# EAGLE design Grove - GPS v1.1 (EAGLE 6.3)
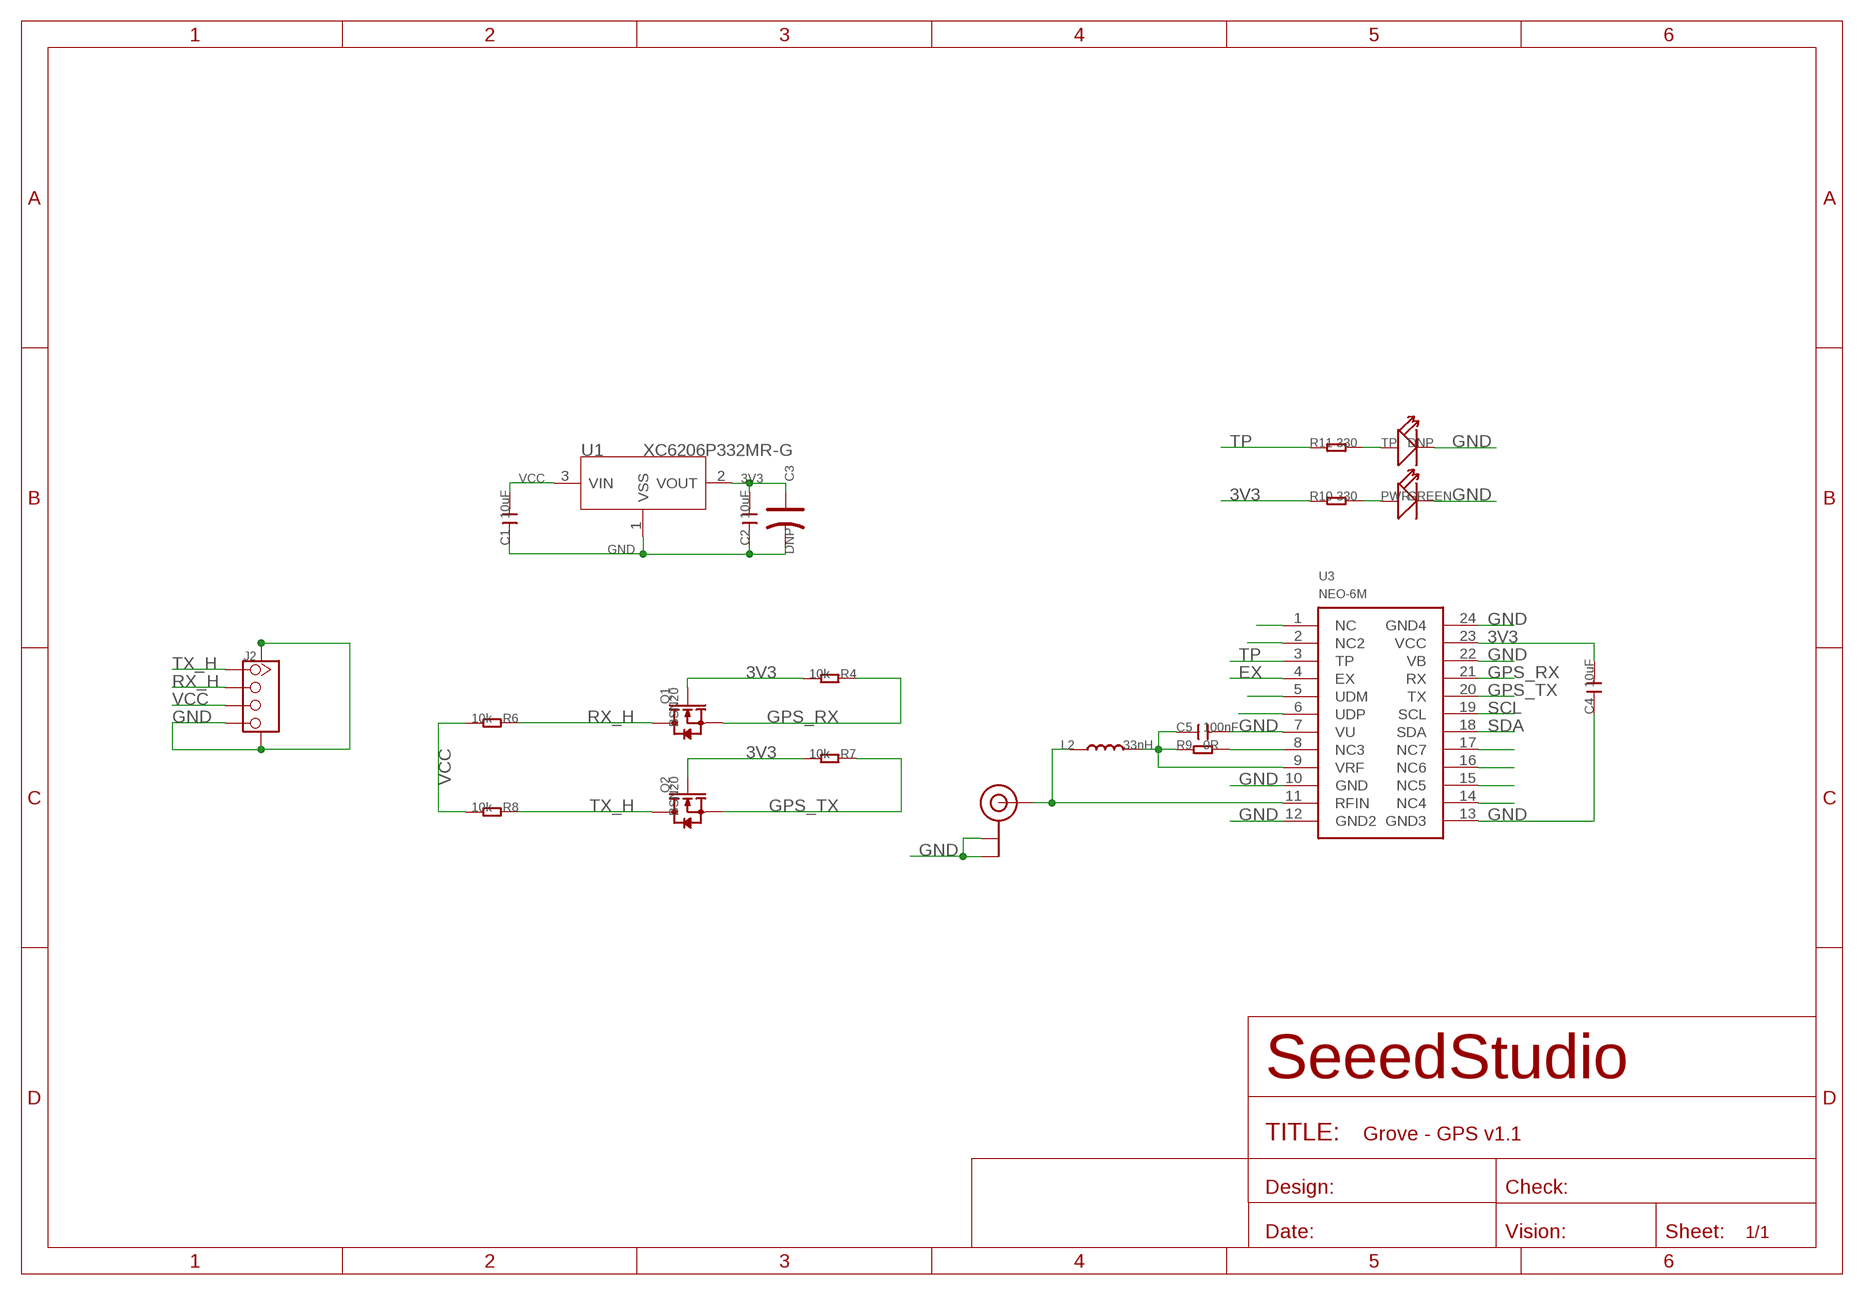
[diagram p0: schematic, sheet 1]

## Parts
C1  10uF  C-0805  [C0805]
C2  10uF  C-0805  [C0805]
C3  DNP  CAP-AVX-A  [AVX-A]
C4  10uF  C-0805  [C0805]
C5  100nF  C-0603  [C0603]
J2  TWIG-4P-2.0-SMD-FEMALE-REINFORCE'DD'  [4P-SMD-2.0]
L2  33nH  L'0603'  [L0603]
PWR  GREEN  LED'0603'  [LED-0603]
Q1  BSN20  MOSFET-N'SOT23'  [SOT23]
Q2  BSN20  MOSFET-N'SOT23'  [SOT23]
R4  10k  R-0603  [R0603]
R6  10k  R-0603  [R0603]
R7  10k  R-0603  [R0603]
R8  10k  R-0603  [R0603]
R9  0R  R-0603  [R0603]
R10  330  R-0603  [R0603]
R11  330  R-0603  [R0603]
TP  DNP  LED'0603'  [LED-0603]
U1  XC6206P332MR-G  XC6206MR  [SOT23]
U3  NEO-6M  [28P-1.1-16.0X12.2]
U4  U.FL  [U.FL]

## Nets
3V3: C2.2 C3.+ C4.2 Q1.1(G) Q2.1(G) R4.2 R7.2 R10.1 U1.2(VOUT) U3.23(VCC)
EX: U3.4(EX)
GND: C1.1 C2.1 C3.- C4.1 C5.2 J2.4 J2.SS1 J2.SS2 PWR.- TP.- U1.1(VSS) U3.7(VU) U3.10(GND) U3.12(GND2) U3.13(GND3) U3.22(VB) U3.24(GND4) U4.P$1(GND) U4.P$2(GND)
GPS_RX: Q1.2(S) R4.1 U3.21(RX)
GPS_TX: Q2.2(S) R7.1 U3.20(TX)
N$1: U3.1(NC)
N$2: L2.1 U3.11(RFIN) U4.P$3(SIGNAL)
N$3: C5.1 L2.2 R9.1 U3.9(VRF)
N$4: U3.2(NC2)
N$5: U3.14(NC4)
N$6: PWR.+ R10.2
N$7: R9.2 U3.8(NC3)
N$8: U3.15(NC5)
N$9: R11.2 TP.+
N$10: U3.16(NC6)
N$11: U3.17(NC7)
N$12: U3.5(UDM)
N$13: U3.6(UDP)
RX_H: J2.2 Q1.3(D) R6.1
SCL: U3.19(SCL)
SDA: U3.18(SDA)
TP: R11.1 U3.3(TP)
TX_H: J2.1 Q2.3(D) R8.1
VCC: C1.2 J2.3 R6.2 R8.2 U1.3(VIN)

## Library data of the parts
C1 C2 C4 C5 = Discrete:C*: Ceramic Capacitors
C3 = Discrete:CAP*: Electrolytic Capacitors,Tantalum Capacitors and Super Capacitors
J2 = Connector:TWIG-4P-2.0-SMD-FEMALE-REINFORCE
L2 = Discrete:L*
PWR TP = Discrete:LED*
Q1 Q2 = Discrete:MOSFET-N: IRLL014: http://www.vishay.com/docs/91319/sihll014.pdf
R4 R6-R11 = Discrete:R*
U1 = IC:XC6206: LOW ESR Cap.Compatible Positive Voltage Regulators
U3 = template:NEO-6M
U4 = SparkFun2:U.FL

## Net classes
0 default: width 0.003 mm, drill 0.254 mm, clearance 0.152 mm

## Board
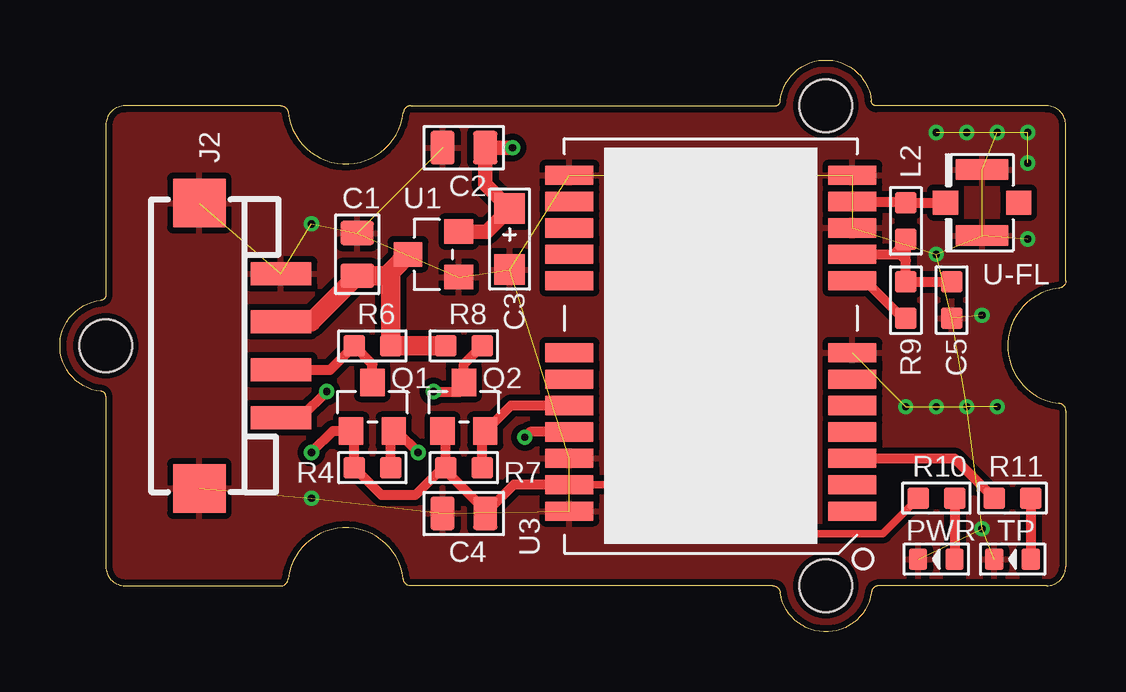
[diagram p1: board, top side]
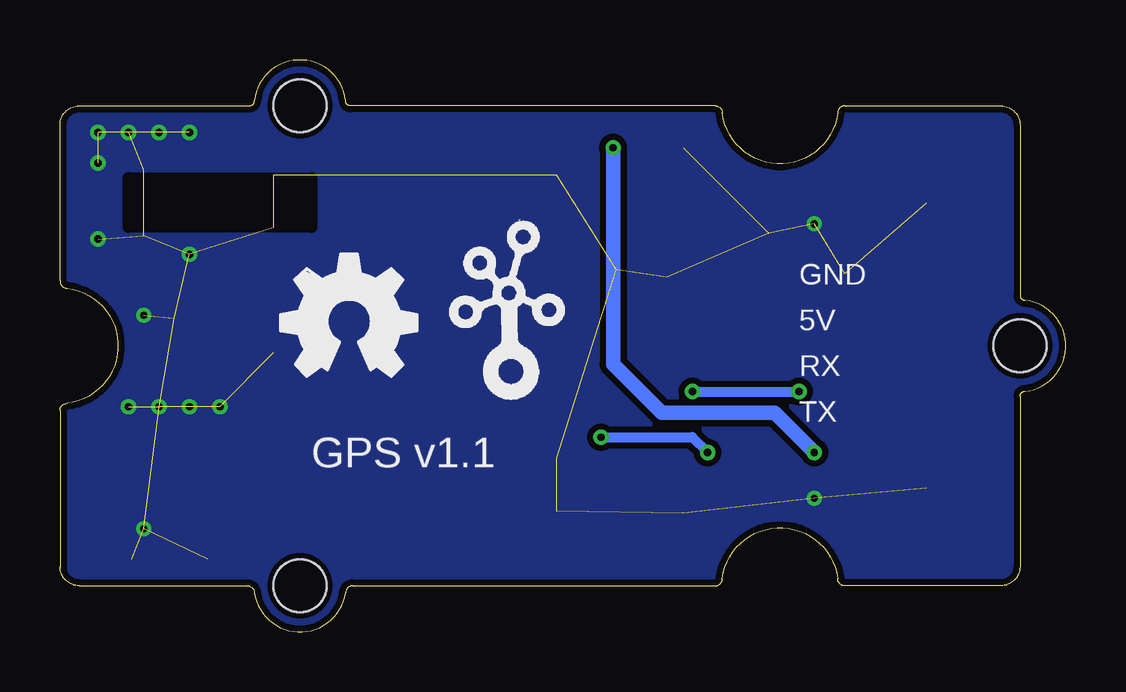
[diagram p2: board, bottom side, seen from below]

Size 41.91 x 23.83 mm. Coordinates in mm from the lower left corner, seen from the top.
Copper layers (1*16): Top 0.035mm / dielectric 1.5mm / Bottom 0.035mm
Design rules "SeeedStudio_rule_no_angle_090911 *": minimum track width 6mil, minimum drill 12mil, track to track 6mil, track to pad 6mil, pad to pad 6mil, via to via 6mil, smd to smd 0mil, copper to edge 10mil, drill to drill 10mil, minimum pad ring 10mil, minimum via ring 6mil, stop-mask expansion 2mil, vias tented up to drill 100mil, thermal gap 10mil
tRestrict: 13 lines
bRestrict: area 31.4,16.9 to 39.1,18.9

### Footprints (pad centres in the part's own frame; a part is rotated, then mirrored left to right if it is on the bottom)
C0805 = smd 1.016 x 1.397: 1 -0.889,0; 2 0.889,0
AVX-A = smd 1.27 x 1.27: + -1.27,0; - 1.27,0
C0603 = smd 0.889 x 0.889: 1 -0.762,0; 2 0.762,0
4P-SMD-2.0 = smd 0.965 x 2.54: 1 -3,0; 2 -1,0; 3 1,0; 4 3,0 | smd 2.032 x 2.184: SS1 -5.946,3.4; SS2 5.946,3.4
L0603 = smd 0.889 x 0.889: 1 -0.762,0; 2 0.762,0
LED-0603 = smd 0.762 x 0.889: + -0.762,0; - 0.762,0
SOT23 = smd 1.016 x 1.143: 1 -0.889,-1.016; 2 0.889,-1.016; 3 0,1.016
R0603 = smd 0.889 x 0.889: 1 -0.762,0; 2 0.762,0
SOT23' = smd 1.016 x 1.2: 1 -0.95,-1.06; 2 0.95,-1.06; 3 0,1.06
28P-1.1-16.0X12.2 = smd 2 x 0.8: 1 -5.904,6.888; 2 -5.904,5.788; 3 -5.904,4.688; 4 -5.904,3.588; 5 -5.904,2.488; 6 -5.904,1.388; 7 -5.904,0.288; 8 -5.904,-2.712; 9 -5.904,-3.812; 10 -5.904,-4.912; 11 -5.904,-6.012; 12 -5.904,-7.112; 13 5.896,-7.112; 14 5.896,-6.012; 15 5.896,-4.912; 16 5.896,-3.812; 17 5.896,-2.712; 18 5.896,0.288; 19 5.896,1.388; 20 5.896,2.488; 21 5.896,3.588; 22 5.896,4.688; 23 5.896,5.788; 24 5.896,6.888
U.FL = smd 2.2 x 0.85: P$1 0,1.375; P$2 0,-1.375 | smd 1.05 x 1: P$3 1.525,0; P$4 -1.525,0
2U-DIM-W/DRILL = hole 2.2: -10,-10; -10,10; 20,0

### Placement (x,y rotation side)
C1  12.38,15.73 270 top
C2  16.83,20.18 0 top
C3  18.73,16.37 270 top
C4  16.83,4.94 0 top
C5  37.15,13.83 270 top
J2  9.21,11.92 90 top
L2  35.24,17.13 270 top
PWR  36.51,3.03 180 top
Q1  13.02,9.38 0 top
Q2  16.83,9.38 0 top
R4  13.02,6.84 180 top
R6  13.02,11.92 0 top
R7  16.83,6.84 180 top
R8  16.83,11.92 180 top
R9  35.24,13.83 270 top
R10  36.51,5.57 0 top
R11  39.69,5.57 0 top
TP  39.69,3.03 180 top
U1  XC6206P332MR-G  [SOT23']  15.56,15.73 90 top
U3  27.12,11.92 180 top
U4  38.42,17.89 180 top
U$1  [2U-DIM-W/DRILL]  21.91,11.92 180 top
U$2  [OSHW_FILLX200_NOTEXT]  32.7,10.65 0 bottom
U$4  [TWIGLOGO]  23.18,10.65 0 bottom

### Tracks (layer width: path | path; a pad name or v marks a point on that pad's centre or on a via)
3V3  (via drill 0.3 pad 0.64)
  Top 0.305: U3.23 26.43,6.13 28.46,4.1 34.28,4.1 R10.1
  Top 0.406: U3.23 18.91,6.13 C4.2 17.84,4.81 17.97,4.81 16.07,6.71 R7.2 | R7.2 16.07,8.18 15.94,8.3 Q2.1 | R7.2 15.94,6.84 14.8,5.7 13.4,5.7 R4.2 12.26,8.24 Q1.1 11.37,8.37 v10.48,7.48
  Top 0.61: U1.2 17.78,16.68 C3.+ 17.72,18.65 C2.2 v18.86,20.18
  Bottom 0.61: v18.86,20.18 18.86,11.16 16.83,9.13 12.13,9.13 v10.48,7.48
GND  (via drill 0.3 pad 0.64)  (33 unrouted)
  other vias: 38.42,4.3 10.48,5.57 36.51,20.81 37.78,20.81 39.05,20.81 40.32,20.81 40.32,19.54 40.32,16.37 36.51,15.73 38.42,13.19 35.24,9.38 36.51,9.38 37.78,9.38 39.05,9.38 10.48,17
  pour Bottom (isolate 0.254): -0.32,-0.14 42.23,-0.14 42.23,23.99 -0.32,23.99
  pour Top (isolate 0.254): -0.32,-0.14 42.23,-0.14 42.23,23.99 -0.32,23.99
GPS_RX  (via drill 0.3 pad 0.64)
  Top 0.406: U3.21 19.59,8.33 v19.37,8.11 | R4.1 13.78,8.24 Q1.2 14.03,8.37 v14.92,7.48
  Bottom 0.406: v19.37,8.11 15.56,8.11 v14.92,7.48
GPS_TX
  Top 0.406: U3.20 18.79,9.43 Q2.2 17.59,8.24 R7.1
N$2
  Top 0.406: U3.11 35.2,17.93 L2.1 U4.P$3
N$3
  Top 0.406: 35.24,15.48 R9.1 C5.1 | 35.24,15.48 35.24,15.86 | 35.24,15.86 L2.2 | U3.9 34.74,15.73 | 34.99,15.73 35.12,15.73 35.24,15.86 | 34.74,15.73 35.12,16.11 | 34.74,15.73 34.99,15.73 | 34.99,15.73 35.24,15.48
N$6
  Top 0.406: R10.2 PWR.+
N$7
  Top 0.406: R9.2 35.12,13.06 33.59,14.59 33.06,14.59 U3.8
N$9
  Top 0.406: R11.2 TP.+
RX_H
  Top 0.406: J2.2 11.26,10.92 R6.1 13.02,11.16 Q1.3
TP
  Top 0.406: U3.3 37.26,7.23 R11.1
TX_H  (via drill 0.3 pad 0.64)
  Top 0.406: R8.1 16.83,11.16 Q2.3 16.7,10.27 16.7,10.02 v15.56,10.02 | J2.1 9.29,9 10.1,9 v11.11,10.02
  Bottom 0.406: v15.56,10.02 v11.11,10.02
VCC
  Top 0.813: R8.2 R6.2 13.78,15.01 | J2.3 10.46,12.92 C1.2 13.61,14.84 13.78,15.01 | U1.3 13.82,15.06 13.78,15.01

### Text on the board
tPlace: J2 | U-FL
bPlace: GND | 5V | RX | TX | GPS v1.1